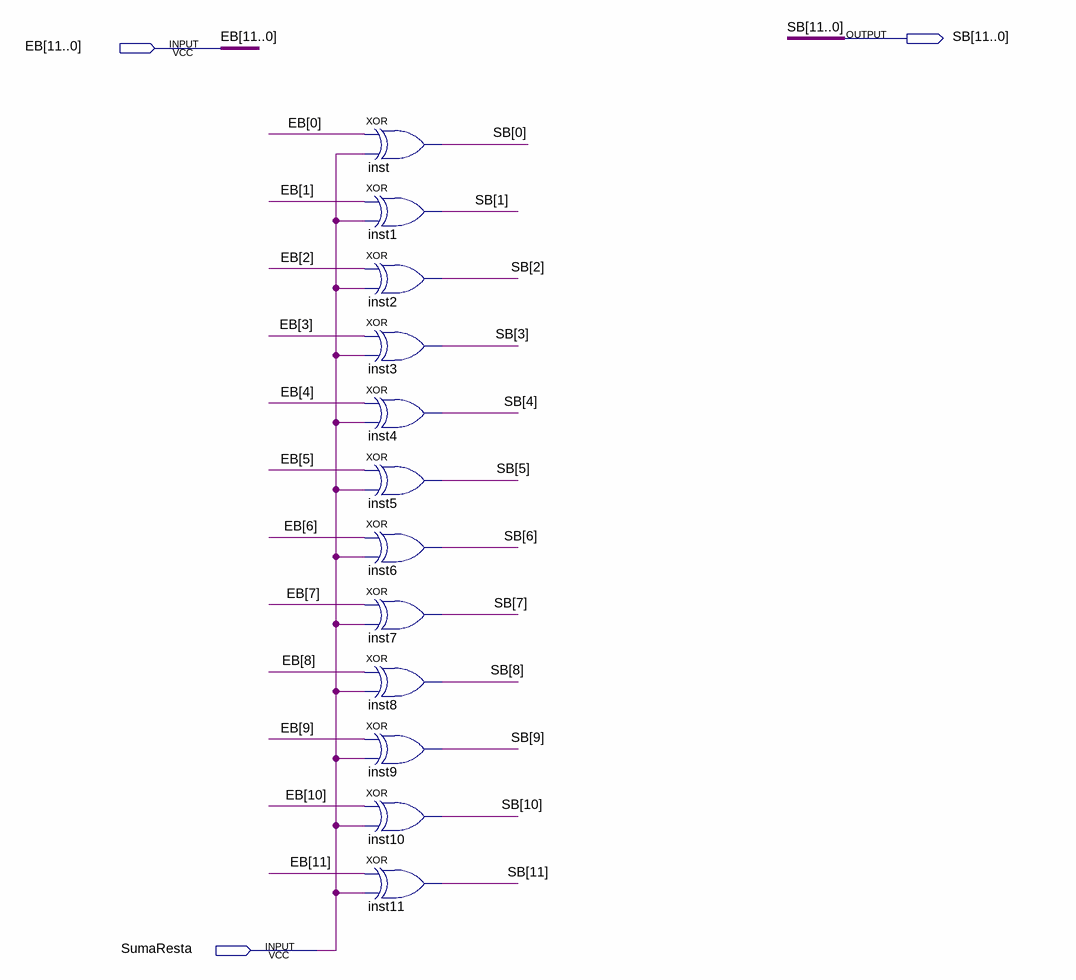
[diagram p0: schematic sheet]
// Quartus schematic moduloInversor.bdf as structural Verilog: 12 symbols, 3 pins
module moduloInversor (
  input  [11:0] EB,
  input  SumaResta,
  output [11:0] SB
);

  xor inst (SB[0], EB[0], SumaResta);
  xor inst1 (SB[1], EB[1], SumaResta);
  xor inst2 (SB[2], EB[2], SumaResta);
  xor inst3 (SB[3], EB[3], SumaResta);
  xor inst4 (SB[4], EB[4], SumaResta);
  xor inst5 (SB[5], EB[5], SumaResta);
  xor inst6 (SB[6], EB[6], SumaResta);
  xor inst7 (SB[7], EB[7], SumaResta);
  xor inst8 (SB[8], EB[8], SumaResta);
  xor inst9 (SB[9], EB[9], SumaResta);
  xor inst10 (SB[10], EB[10], SumaResta);
  xor inst11 (SB[11], EB[11], SumaResta);
endmodule
